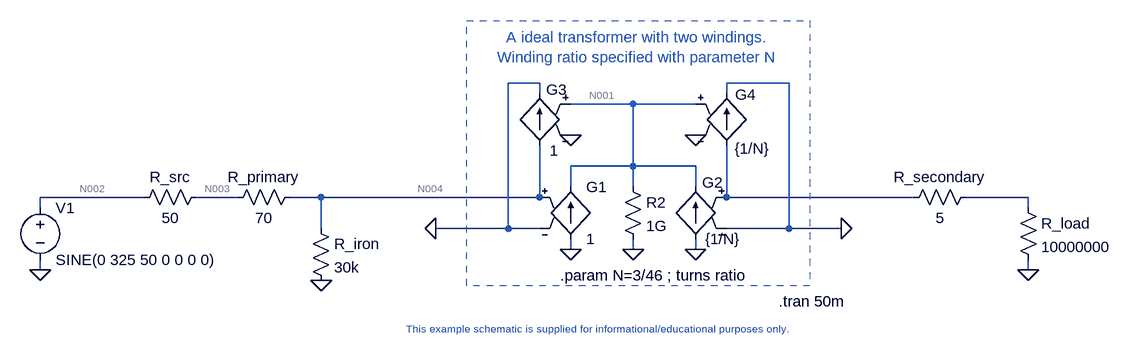
[diagram p0: schematic lab_2_hw.asc]
lab_2_hw.asc, the LTspice schematic file:
Version 4
SHEET 1 1052 680
WIRE 160 0 112 0
WIRE 544 0 448 0
WIRE 160 16 160 0
WIRE 448 16 448 0
WIRE 304 32 208 32
WIRE 400 32 304 32
WIRE 304 128 304 32
WIRE 304 128 208 128
WIRE 400 128 304 128
WIRE 208 160 208 128
WIRE 304 160 304 128
WIRE 400 160 400 128
WIRE -448 176 -608 176
WIRE -304 176 -368 176
WIRE -176 176 -224 176
WIRE 160 176 160 96
WIRE 160 176 -176 176
WIRE 448 176 448 96
WIRE 736 176 448 176
WIRE 912 176 816 176
WIRE -608 192 -608 176
WIRE 912 192 912 176
WIRE -176 224 -176 176
WIRE 112 224 112 0
WIRE 112 224 0 224
WIRE 160 224 112 224
WIRE 544 224 544 0
WIRE 544 224 448 224
WIRE 624 224 544 224
WIRE 208 256 208 240
WIRE 304 256 304 240
WIRE 400 256 400 240
WIRE -608 288 -608 272
WIRE 912 288 912 272
FLAG -608 288 0
FLAG 400 256 0
FLAG 208 256 0
FLAG 208 80 0
FLAG 400 80 0
FLAG 304 256 0
FLAG 0 224 0
FLAG 624 224 0
FLAG 912 288 0
FLAG -176 304 0
SYMBOL voltage -608 176 R0
WINDOW 123 0 0 Left 0
WINDOW 39 0 0 Left 0
SYMATTR InstName V1
SYMATTR Value SINE(0 325 50 0 0 0 0)
SYMBOL res -352 160 R90
WINDOW 0 0 56 VBottom 2
WINDOW 3 32 56 VTop 2
SYMATTR InstName R_src
SYMATTR Value 50
SYMBOL g 208 144 R0
SYMATTR InstName G1
SYMATTR Value 1
SYMBOL g 400 144 M0
WINDOW 0 -10 9 Right 2
WINDOW 3 -15 96 Right 2
SYMATTR InstName G2
SYMATTR Value {1/N}
SYMBOL g 160 0 M0
WINDOW 0 -10 10 Right 2
WINDOW 3 -16 104 Right 2
SYMATTR InstName G3
SYMATTR Value 1
SYMBOL g 448 0 R0
WINDOW 0 13 18 Left 2
WINDOW 3 12 101 Left 2
SYMATTR InstName G4
SYMATTR Value {1/N}
SYMBOL res 288 144 R0
SYMATTR InstName R2
SYMATTR Value 1G
SYMBOL res 896 176 R0
SYMATTR InstName R_load
SYMATTR Value 10000000
SYMBOL res -208 160 R90
WINDOW 0 0 56 VBottom 2
WINDOW 3 32 56 VTop 2
SYMATTR InstName R_primary
SYMATTR Value 70
SYMBOL res -192 208 R0
SYMATTR InstName R_iron
SYMATTR Value 30k
SYMBOL res 832 160 R90
WINDOW 0 0 56 VBottom 2
WINDOW 3 32 56 VTop 2
SYMATTR InstName R_secondary
SYMATTR Value 5
TEXT 528 336 Left 2 !.tran 50m
TEXT 240 368 Top 1 ;This example schematic is supplied for informational/educational purposes only.
TEXT 312 -24 Bottom 2 ;A ideal transformer with two windings.\nWinding ratio specified with parameter N
TEXT 192 296 Left 2 !.param N=3/46 ; turns ratio
RECTANGLE Normal 576 312 48 -96 2

The netlist it stands for:
* lab_2_hw.asc
V1 N002 0 SINE(0 325 50 0 0 0 0)
R_src N003 N002 50
G1 0 N001 N004 0 1
G2 0 N001 N005 0 {1/N}
G3 N004 0 N001 0 1
G4 N005 0 N001 0 {1/N}
R2 N001 0 1G
R_load N006 0 10000000
R_primary N004 N003 70
R_iron N004 0 30k
R_secondary N006 N005 5
.tran 50m
* This example schematic is supplied for informational/educational purposes only.
* A ideal transformer with two windings.
* Winding ratio specified with parameter N
.param N=3/46 ; turns ratio
.backanno
.end

* Results of the author's LTspice run, read from the files saved beside the schematic
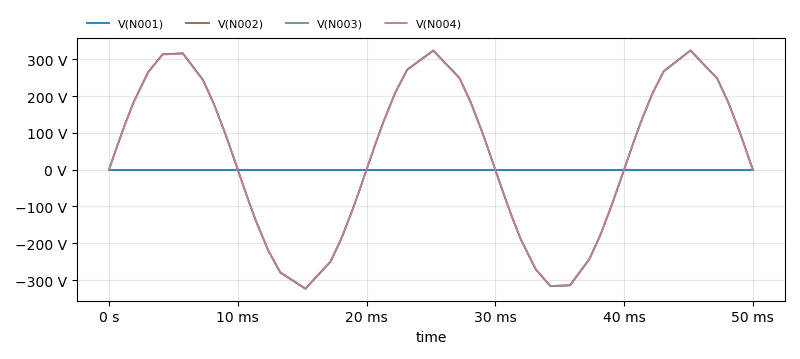
[diagram p1: Transient Analysis of lab_2_hw.asc, plotted from the saved traces]
* Transient Analysis, 1 run:
*   V(N001): min -137.1 nV, max 137.4 nV, average 17.06 nV, rms 95.86 nV, last 0 V
*   V(N002): min -323.7 V, max 324.3 V, average 40.28 V, rms 226.3 V, last 0 V
*   V(N003): min -323.2 V, max 323.7 V, average 40.21 V, rms 225.9 V, last 0 V
*   V(N004): min -322.4 V, max 323 V, average 40.11 V, rms 225.4 V, last 0 V